# Altium project PLWD_Schematic.PrjPcb (part 2 of 2)

## Sheet PLWD_LTE_modem.SchDoc: UG96_Modem
size A3; Date: Not used; ApprovedBy: Not used; CheckedBy: Not used; Author: Not used; CompanyName: STMicroelectronics; DrawnBy: Not used; Engineer: Not used; Organization: Not used; Address1: Not used; Address2: Not used; Address3: Not used; Address4: Not used; DocumentNumber: 1; Revision: Not used; SheetNumber: 6; SheetTotal: 11; CurrentTime: Not used; CurrentDate: Not used; Time: Not used; DocumentFullPathAndName: Not used; DocumentName: Not used; ModifiedDate: Not used; ImagePath: Not used; ProjectName: Not used; Application_BuildNumber: Not used
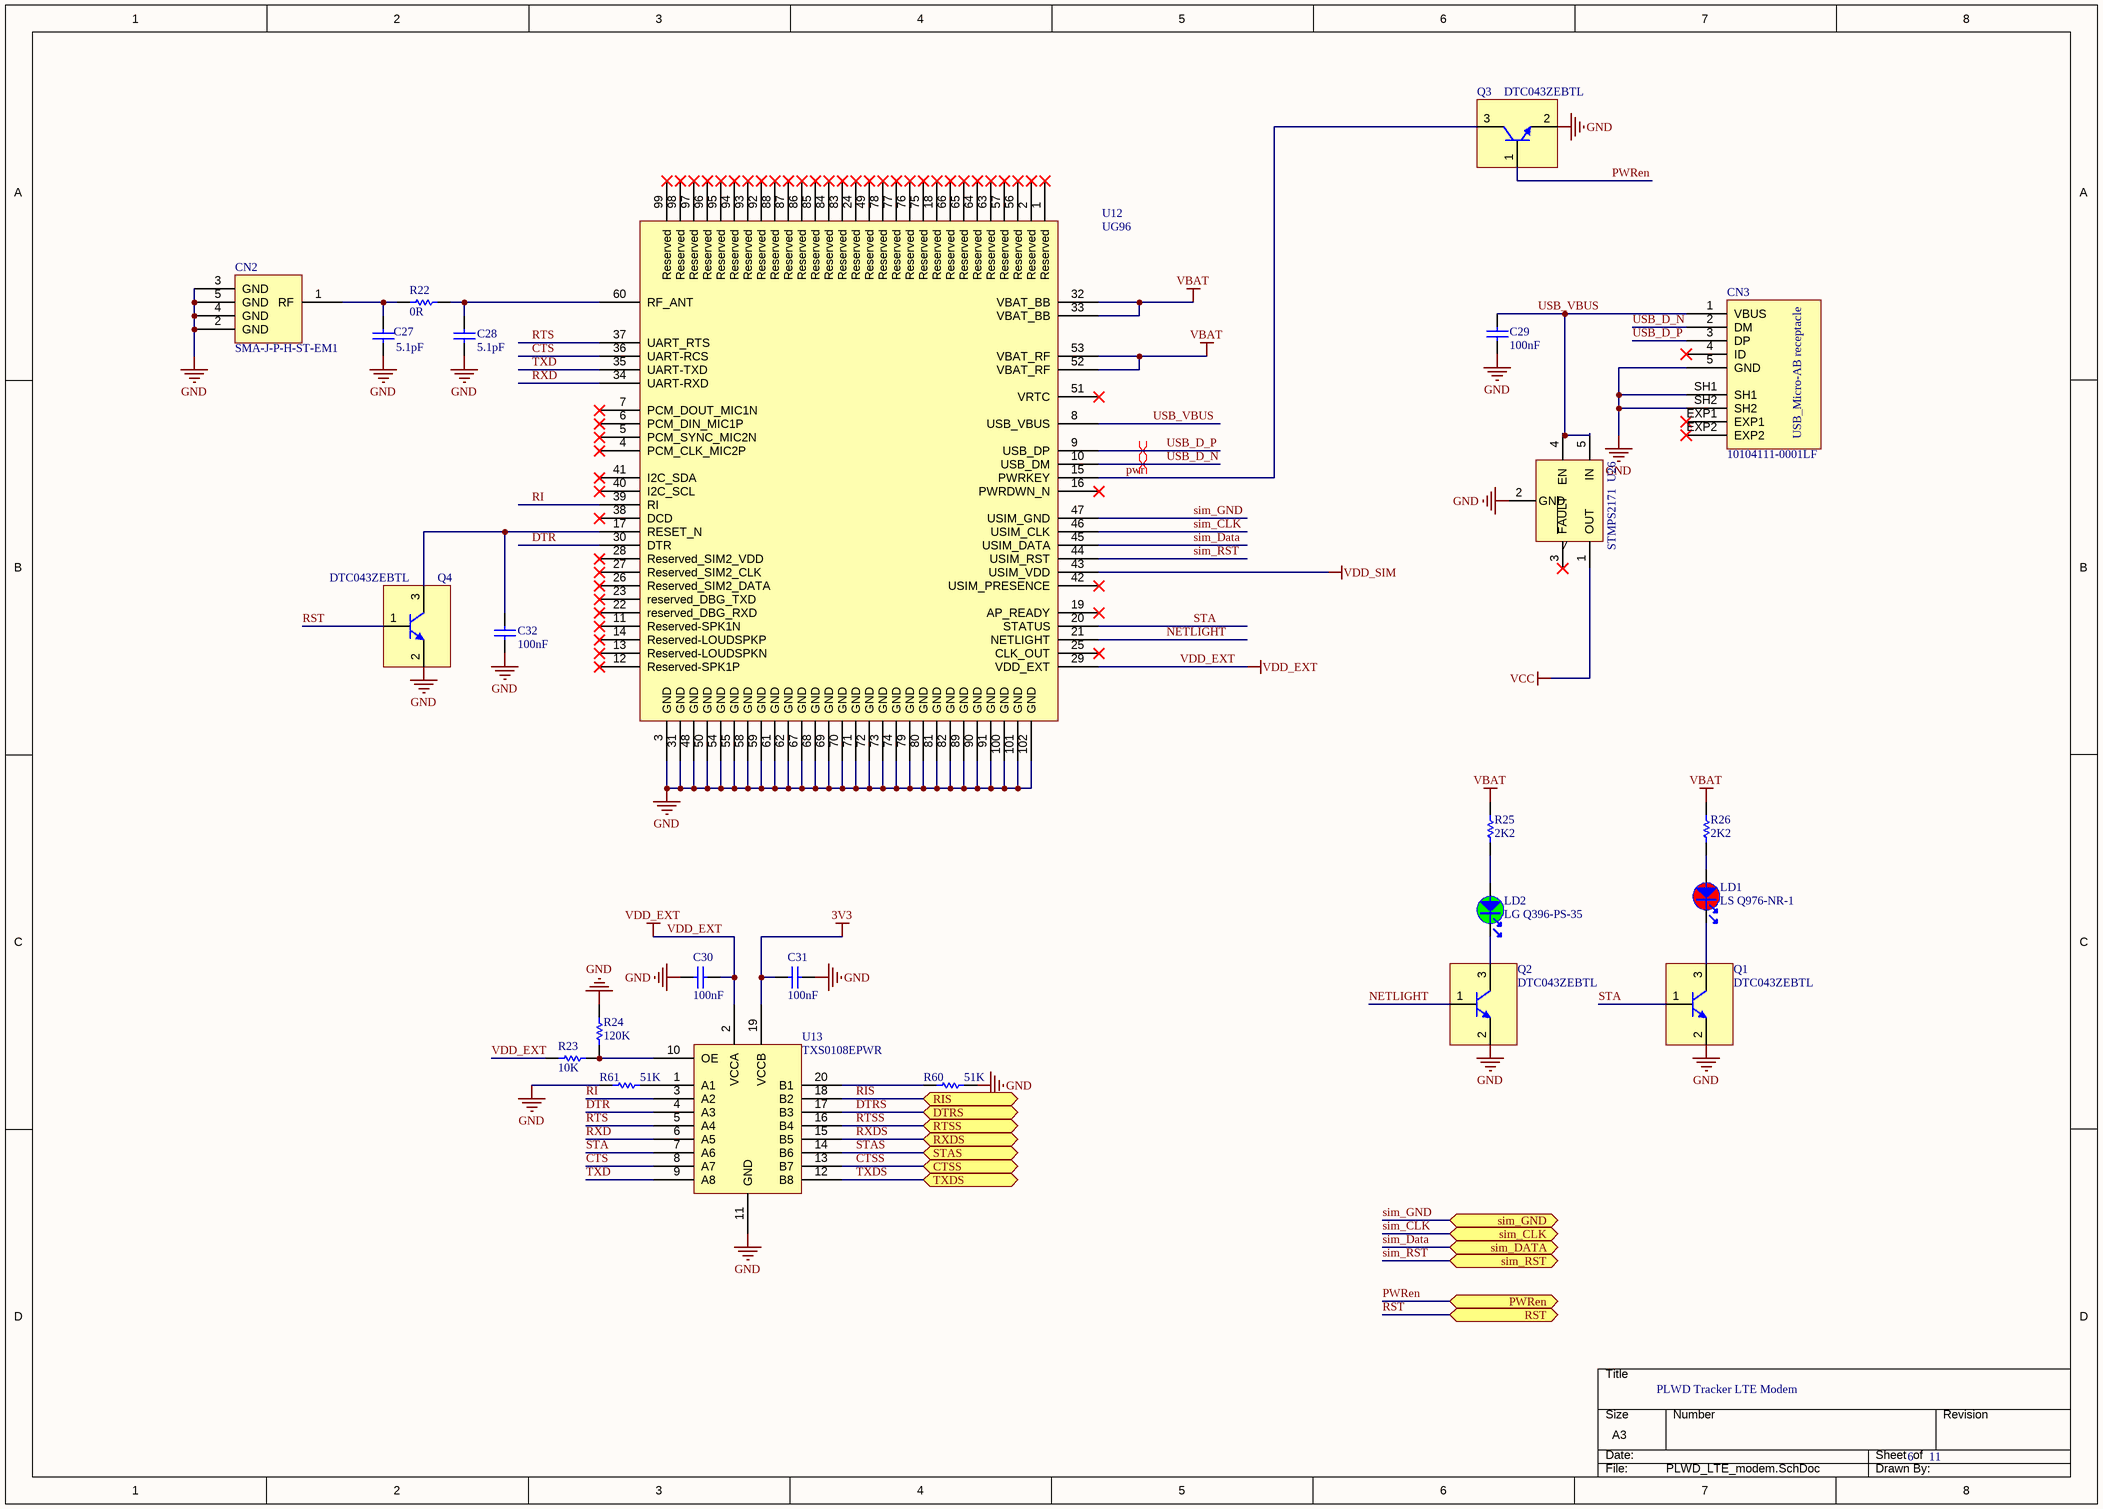
[diagram p8: PLWD_LTE_modem.SchDoc]

### Parts
C27  value 5.1pF  [C0402]  (hidden comment: Capacitor)
C28  value 5.1pF  [C0402]  (hidden comment: Capacitor)
C29  value 100nF  [C0402]  (hidden comment: Capacitor)
C30  value 100nF  [C0402]  (hidden comment: Capacitor)
C31  value 100nF  [C0402]  (hidden comment: Capacitor)
C32  value 100nF  [C0402]  (hidden comment: Capacitor)
CN2  SMA-J-P-H-ST-EM1  [CON_SAMTEC_SMA-J-P-X-ST-EM1]
CN3  value 10104111-0001LF  [CON_USBMICROAB_FCI_10104111-0001LF]  (hidden comment: USB_uAB_10104111-0001LF)
LD1  value LS Q976-NR-1  [LED_0603_RED]  (hidden comment: LED_red)
LD2  value LG Q396-PS-35  [LED_0603_GREEN]  (hidden comment: LED_green)
Q1  DTC043ZEBTL  [NPN_SOT416-FL_EMT3F_1616_SC89]
Q2  DTC043ZEBTL  [NPN_SOT416-FL_EMT3F_1616_SC89]
Q3  DTC043ZEBTL  [NPN_SOT416-FL_EMT3F_1616_SC89]
Q4  DTC043ZEBTL  [NPN_SOT416-FL_EMT3F_1616_SC89]
R22  value 0R  [R0402]  (hidden comment: Resistor)
R23  value 10K  [R0603]  (hidden comment: Resistor)
R24  value 120K  [R0402]  (hidden comment: Resistor)
R25  value 2K2  [R0402]  (hidden comment: Resistor)
R26  value 2K2  [R0402]  (hidden comment: Resistor)
R60  value 51K  [R0402]  (hidden comment: Resistor)
R61  value 51K  [R0402]  (hidden comment: Resistor)
U12  UG96  [MOD_2G-3G_QUECTEL_UG96-UG95-M95-R2-0_COMPATIBLE-DESIGN-V1-0]
U13  TXS0108EPWR  [ICC_TSSOP20_6P50X4P40_P065]
U26  value STMPS2171  [MOS_SOT23-5L]  (hidden comment: STMPS2171STR)

### Ports
CTSS (bidir), DTRS (bidir), PWRen (bidir), RIS (bidir), RST (bidir), RTSS (bidir), RXDS (bidir), sim_CLK (bidir), sim_DATA (bidir), sim_GND (bidir), sim_RST (bidir), STAS (bidir), TXDS (bidir)

### Nets
3V3: C31.1 U13.19(VCCB)
GND: C27.1 C28.1 C29.1 C30.1 C31.2 C32.1 CN2.2(GND) CN2.3(GND) CN2.4(GND) CN2.5(GND) CN3.5(GND) CN3.SH1 CN3.SH2 Q1.2(E) Q2.2(E) Q3.2(E) Q4.2(E) R24.2 R60.2 R61.1 U12.3(GND) U12.31(GND) U12.48(GND) U12.50(GND) U12.54(GND) U12.55(GND) U12.58(GND) U12.59(GND) U12.61(GND) U12.62(GND) U12.67(GND) U12.68(GND) U12.69(GND) U12.70(GND) U12.71(GND) U12.72(GND) U12.73(GND) U12.74(GND) U12.79(GND) U12.80(GND) U12.81(GND) U12.82(GND) U12.89(GND) U12.90(GND) U12.91(GND) U12.100(GND) U12.101(GND) U12.102(GND) U13.11(GND) U26.2(GND)
VBAT: R25.2 R26.2 U12.32(VBAT_BB) U12.33(VBAT_BB) U12.52(VBAT_RF) U12.53(VBAT_RF)
VCC: U26.1(OUT)
VDD_EXT: C30.2 R23.1 U12.29(VDD_EXT) U13.2(VCCA)
VDD_SIM: U12.43(USIM_VDD)
CTS: U12.36(UART-RCS) U13.8(A7)
CTSS: U13.13(B7) ; port CTSS
DTR: U12.30(DTR) U13.4(A3)
DTRS: U13.17(B3) ; port DTRS
NETLIGHT: Q2.1(B) U12.21(NETLIGHT)
pwr: Q3.3(C) U12.15(PWRKEY)
PWRen: Q3.1(B) ; port PWRen
RI: U12.39(RI) U13.3(A2)
RIS: U13.18(B2) ; port RIS
RST: Q4.1(B) U12.44(USIM_RST) ; port RST, port sim_RST  [also labelled sim_RST]
RTS: U12.37(UART_RTS) U13.5(A4)
RTSS: U13.16(B4) ; port RTSS
RXD: U12.34(UART-RXD) U13.6(A5)
RXDS: U13.15(B5) ; port RXDS
sim_CLK: U12.46(USIM_CLK) ; port sim_CLK
sim_Data: U12.45(USIM_DATA) ; port sim_DATA
sim_GND: U12.47(USIM_GND) ; port sim_GND
STA: Q1.1(B) U12.20(STATUS) U13.7(A6)
STAS: U13.14(B6) ; port STAS
TXD: U12.35(UART-TXD) U13.9(A8)
TXDS: U13.12(B8) ; port TXDS
USB_D_N: CN3.2(DM) U12.10(USB_DM)
USB_D_P: CN3.3(DP) U12.9(USB_DP)
USB_VBUS: C29.2 CN3.1(VBUS) U12.8(USB_VBUS) U26.4(EN) U26.5(IN)
NetC27_2: C27.2 CN2.1(RF) R22.1
NetC28_2: C28.2 R22.2 U12.60(RF_ANT)
NetC32_2: C32.2 Q4.3(C) U12.17(RESET_N)
NetLD1_1: LD1.1 R26.1
NetLD1_2: LD1.2 Q1.3(C)
NetLD2_1: LD2.1 R25.1
NetLD2_2: LD2.2 Q2.3(C)
NetR23_2: R23.2 R24.1 U13.10(OE)
NetR60_1: R60.1 U13.20(B1)
NetR61_2: R61.2 U13.1(A1)

Not connected (* = marked no-connect by the designer): CN3 4(ID)* EXP1* EXP2*; U12 1(Reserved)* 2(Reserved)* 4(PCM_CLK_MIC2P)* 5(PCM_SYNC_MIC2N)* 6(PCM_DIN_MIC1P)* 7(PCM_DOUT_MIC1N)* 11(Reserved-SPK1N)* 12(Reserved-SPK1P)* 13(Reserved-LOUDSPKN)* 14(Reserved-LOUDSPKP)* 16(PWRDWN_N)* 18(Reserved)* 19(AP_READY)* 22(reserved_DBG_RXD)* 23(reserved_DBG_TXD)* 24(Reserved)* 25(CLK_OUT)* 26(Reserved_SIM2_DATA)* 27(Reserved_SIM2_CLK)* 28(Reserved_SIM2_VDD)* 38(DCD)* 40(I2C_SCL)* 41(I2C_SDA)* 42(USIM_PRESENCE)* 49(Reserved)* 51(VRTC)* 56(Reserved)* 57(Reserved)* 63(Reserved)* 64(Reserved)* 65(Reserved)* 66(Reserved)* 75(Reserved)* 76(Reserved)* 77(Reserved)* 78(Reserved)* 83(Reserved)* 84(Reserved)* 85(Reserved)* 86(Reserved)* 87(Reserved)* 88(Reserved)* 92(Reserved)* 93(Reserved)* 94(Reserved)* 95(Reserved)* 96(Reserved)* 97(Reserved)* 98(Reserved)* 99(Reserved)*; U26 3(~{FAULT})*

### Layout directives
differential pair: USB_D_N, USB_D_P

### Notes on the sheet
- PLWD Tracker LTE Modem
- 6
- 11
- DWG NO:
- REV:
- THIS DOCUMENT AND THE DATA DISCLOSED HEREIN OR
- HEREWITH IS THE PROPERTY OF ALTIUM LIMITED AND MAY
- BE FREELY DISTRIBUTED IN WHOLE. NO RIGHTS ARE
- RESERVED OR EXPRESS OR IMPLIED WARANTEE GIVEN.
- REVISION
- DESCRIPTION
- DATE
- APPROVED
- ENG:
- APPROVALS
- PROJECT
- DSN:
- CHK:
- REFERENCE DOCUMENTS
- PROJECT REVISION:
- TITLE
- DOCUMENT REVISION:
- DESIGN ITEM:
- BOM:
- FAB DWG:
- PCB DWG:
- ASSY DWG:
- SCALE:
- A2
- SIZE
- CAGE CODE
- FILE NAME
- DWG NO.
- SHEET
- OF
- REV
- (in symbol MCD-01075) USB_Micro-AB receptacle

### Library data of the parts
C27 C28 = MCD-00003: Capacitor, 5.1pF, 50V, NPO, -+0.25pF, 0402, YAGEO; Manufacturer_Part_Number: CC0402CRNPO9BN5R1; Provided_By: Subcon; Internal_Part_Number: MCD-00003; PartType: Capacitors; ComponentLink1URL: Yageo_Capacitor_NP0_16V-to-50V.pdf; ECCN_US: n/a; ECCN_EU: n/a; Manufacturer: YAGEO; ComponentLink1Description: Yageo_Capacitor_NP0_16V-to-50V.pdf
C29-C32 = MCD-00006: Capacitor,100nF,16V,X7R,10%,0402,YAGEO; Manufacturer_Part_Number: CC0402KRX7R7BB104; Provided_By: Subcon; Internal_Part_Number: MCD-00006; PartType: Capacitors; ComponentLink1URL: Yageo_Capacitor_X7R-series.pdf; ECCN_US: n/a; ECCN_EU: n/a; Manufacturer: YAGEO; ComponentLink1Description: Yageo_Capacitor_X7R-series.pdf
CN2 = MCD-00279: RF SMA connector PCB edge; Manufacturer: SAMTEC; Provided_By: Subcon; Internal_Part_Number: MCD-00279; Value: SMA-J-P-H-ST-EM1; Status: check on going; PartType: Connectors; Manufacturer_Part_Number: SMA-J-P-H-ST-EM1; ComponentLink1Description: sma-j-p-x-st-em1-mkt.pdf
CN3 = MCD-01075: USB, micro AB receptacle,10104111-0001LF; Part_Type: Connector; Manufacturer: FCI; Provided_By: Subcon; Initial_Board_Reference: MB1329; Internal_Part_Number: MCD-01075; Status: Symbol available; Manufacturer_Part_Number: 10104111-0001LF; ComponentLink1Description: FCI_CONNECTOR_USB_uAB_10104111-0001LF; ComponentLink1URL: http://tunmcdsvn.tun.st.com/Component_Datasheet_Library/Trunk/Connectors/FCI_CONNECTOR_USB_uAB_10104111-0001LF; ECCN_US: n/a; ECCN_EU: n/a
LD1 = MCD-00332: red color LED; Manufacturer_Part_Number: Q65111A3964; Manufacturer: OSRAM; Provided_By: Subcon; Internal_Part_Number: MCD-00332; PartType: LED; ComponentLink1Description: LS Q976-NR-1.pdf
LD2 = MCD-00331: Green color LED; Manufacturer_Part_Number: Q65111A3964; Manufacturer: OSRAM; Provided_By: Subcon; Internal_Part_Number: MCD-00331; PartType: LED; ComponentLink1Description: LG Q396-PS-35.pdf
Q1-Q4 = MCD-00280: Buffer transistor; Manufacturer: Rohm; Provided_By: Subcon; Internal_Part_Number: MCD-00280; Value: DTC043ZEBTL; PartType: ICS; Manufacturer_Part_Number: DTC043ZEBTL; ComponentLink1Description: DTC043Z-series,pdf
R22 = MCD-00052: Resistor,0R,0402,5%,YAGEO; Manufacturer_Part_Number: RC0402JR-070RL; Provided_By: Subcon; Internal_Part_Number: MCD-00052; PartType: Resistors; ComponentLink1URL: Yageo_Resistor_RC0402-series.pdf; ECCN_US: n/a; ECCN_EU: n/a; Manufacturer: YAGEO; ComponentLink1Description: Yageo_Resistor_RC0402-series.pdf
R23 = MCD-00220: Resistor,10K,0603,1%,YAGEO; Manufacturer_Part_Number: RC0603FR-0710KL; Provided_By: Subcon; Internal_Part_Number: MCD-00220; PartType: Resistors; ComponentLink1URL: Yageo_Resistor_RC0603-series.pdf; ECCN_US: n/a; ECCN_EU: n/a; Manufacturer: YAGEO; ComponentLink1Description: Yageo_Resistor_RC0603-series.pdf
R24 = MCD-00166: Resistor,120K,0402,1%,YAGEO; Manufacturer_Part_Number: RC0402FR-07120KL; Provided_By: Subcon; Internal_Part_Number: MCD-00166; PartType: Resistors; ComponentLink1URL: Yageo_Resistor_RC0402-series.pdf; ECCN_US: n/a; ECCN_EU: n/a; Manufacturer: YAGEO; ComponentLink1Description: Yageo_Resistor_RC0402-series.pdf
R25 R26 = MCD-00057: Resistor,2K2,0402,1%,YAGEO; Manufacturer_Part_Number: RC0402FR-072K2L; Provided_By: Subcon; Internal_Part_Number: MCD-00057; PartType: Resistors; ComponentLink1URL: Yageo_Resistor_RC0402-series.pdf; ECCN_US: n/a; ECCN_EU: n/a; Manufacturer: YAGEO; ComponentLink1Description: Yageo_Resistor_RC0402-series.pdf
R60 R61 = MCD-00294: Resistor,51K,0402,1%,YAGEO; Manufacturer_Part_Number: RC0402FR-0751KL; Provided_By: Subcon; Internal_Part_Number: MCD-00294; PartType: Resistors; Manufacturer: YAGEO; ComponentLink1Description: Yageo_Resistor_RC0402-series.pdf; ComponentLink1URL: Yageo_Resistor_RC0402-series.pdf; ECCN_US: n/a; ECCN_EU: n/a
U12 = MCD-00290: cellular modem; Manufacturer: QUECTEL; Provided_By: Subcon; Internal_Part_Number: MCD-00290; Value: UG96; PartType: ICS; Manufacturer_Part_Number: UG96; ComponentLink1Description: UG96_95.pdf
U13 = MCD-00289: bidirectionnal level shifter; Manufacturer: TEXAS INSTRUMENTS; Provided_By: Subcon; Internal_Part_Number: MCD-00289; Value: TXS0108EPWR; PartType: ICS; Manufacturer_Part_Number: TXS0108EPWR; ComponentLink1Description: TXS0108EPWR.pdf
U26 = MCD-00622: IC, 1000mA Enhanced single channel power switches with active high enable pin, 90mR, SOT23-5L; Manufacturer: STMICROELECTRONICS; Provided_By: Subcon; Initial_Board_Reference: MB1264; Internal_Part_Number: MCD-00622; Status: Footprint available; Part_Type: IC; Manufacturer_Part_Number: STMPS2171STR; ComponentLink1Description: STM_PWR-Switch_STMPS2171STR.pdf; ComponentLink1URL: http://tunmcdsvn.tun.st.com/Component_Datasheet_Library/Trunk/IC/STM_PWR-Switch_STMPS2171STR

## Sheet PLWD_LTE_Power.SchDoc: Power
size A3; Date: Not used; ApprovedBy: Not used; CheckedBy: Not used; Author: Not used; CompanyName: STMicroelectronics; DrawnBy: Not used; Engineer: Not used; Organization: Not used; Address1: Not used; Address2: Not used; Address3: Not used; Address4: Not used; DocumentNumber: 3; Revision: Not used; SheetNumber: 7; SheetTotal: 11; CurrentTime: Not used; CurrentDate: Not used; Time: Not used; DocumentFullPathAndName: Not used; DocumentName: Not used; ModifiedDate: Not used; ImagePath: Not used; ProjectName: Not used; Application_BuildNumber: Not used
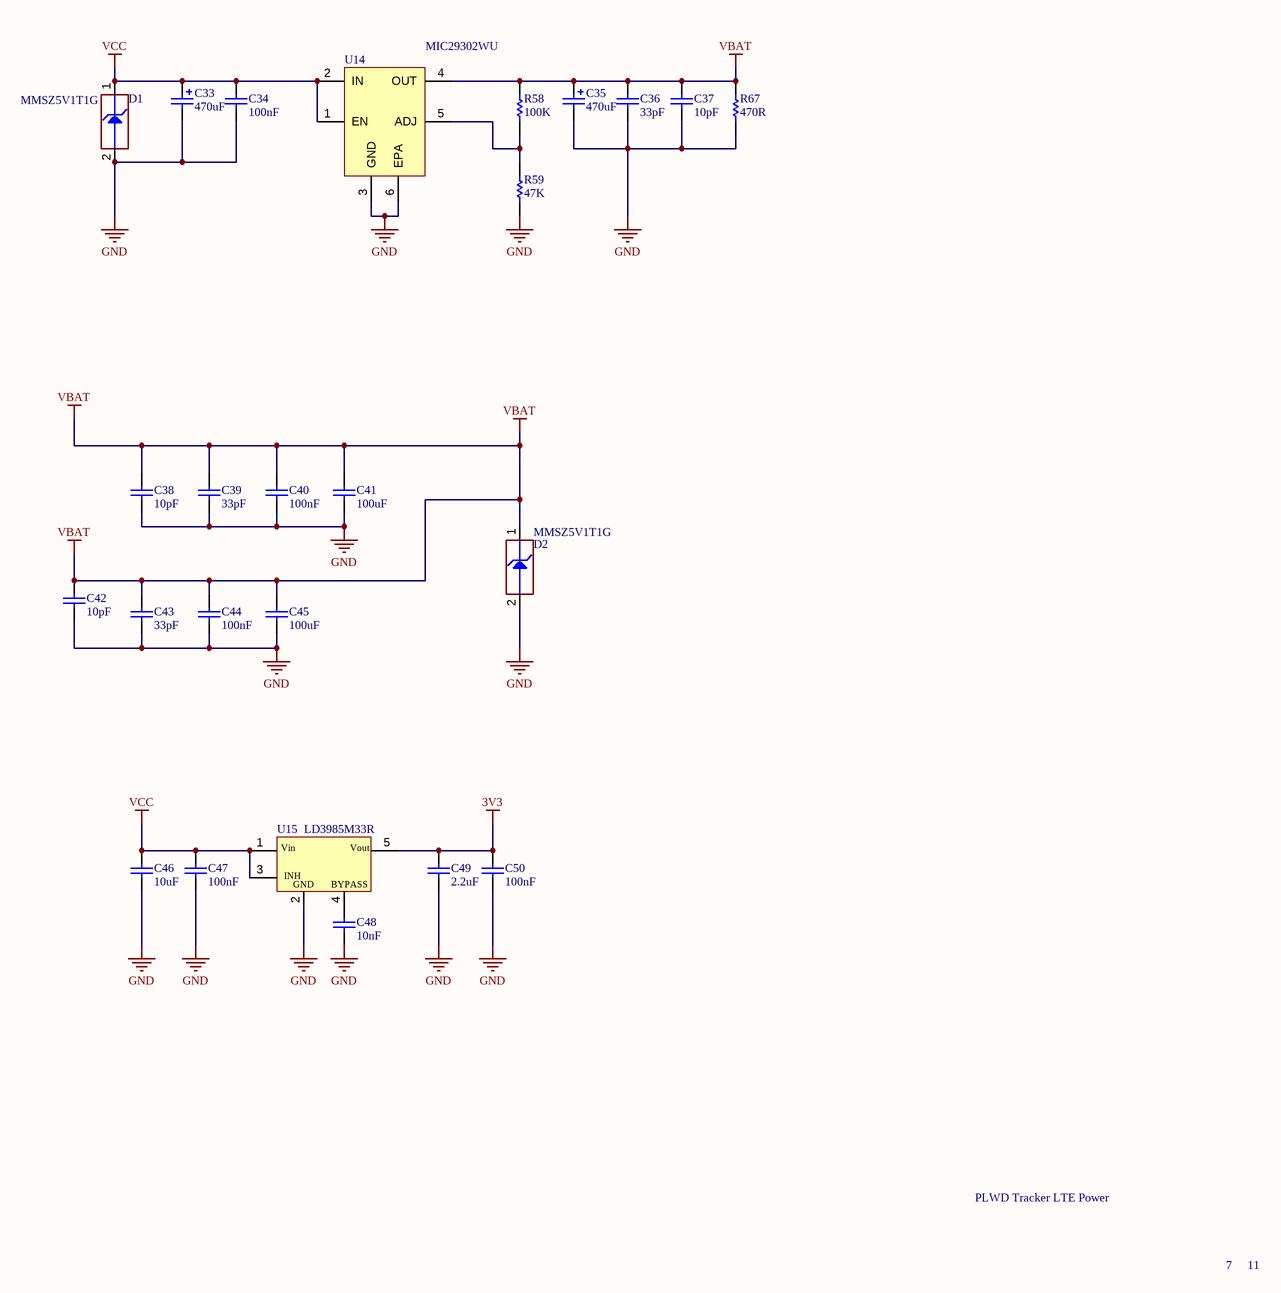
[diagram p9: PLWD_LTE_Power.SchDoc]

### Parts
C33  value 470uF  [CPOL_SANIO_TPB-D4_H380]  (hidden comment: Cap_POL_TANA)
C34  value 100nF  [C0402]  (hidden comment: Capacitor)
C35  value 470uF  [CPOL_SANIO_TPB-D4_H380]  (hidden comment: Cap_POL_TANA)
C36  value 33pF  [C0402]  (hidden comment: Capacitor)
C37  value 10pF  [C0402]  (hidden comment: Capacitor)
C38  value 10pF  [C0402]  (hidden comment: Capacitor)
C39  value 33pF  [C0402]  (hidden comment: Capacitor)
C40  value 100nF  [C0402]  (hidden comment: Capacitor)
C41  value 100uF  [C1210]  (hidden comment: Capacitor)
C42  value 10pF  [C0402]  (hidden comment: Capacitor)
C43  value 33pF  [C0402]  (hidden comment: Capacitor)
C44  value 100nF  [C0402]  (hidden comment: Capacitor)
C45  value 100uF  [C1210]  (hidden comment: Capacitor)
C46  value 10uF  [C0603]  (hidden comment: Capacitor)
C47  value 100nF  [C0402]  (hidden comment: Capacitor)
C48  value 10nF  [C0402]  (hidden comment: Capacitor)
C49  value 2.2uF  [C0603]  (hidden comment: Capacitor)
C50  value 100nF  [C0402]  (hidden comment: Capacitor)
D1  MMSZ5V1T1G  [DIOZ_SOD123_1K_2A]
D2  MMSZ5V1T1G  [DIOZ_SOD123_1K_2A]
R58  value 100K  [R0402]  (hidden comment: Resistor)
R59  value 47K  [R0402]  (hidden comment: Resistor)
R67  value 470R  [R0402]  (hidden comment: Resistor)
U14  MIC29302WU  [LDO_TO263-5L-EPAD_D2PAK_P170]
U15  LD3985M33R  [REG_SOT23-5L]

### Nets
3V3: C49.2 C50.2 U15.5(Vout)
GND: C33.2 C34.2 C35.2 C36.1 C37.1 C38.1 C39.1 C40.2 C41.1 C42.1 C43.1 C44.2 C45.1 C46.1 C47.1 C48.2 C49.1 C50.1 D1.2(A) D2.2(A) R59.1 R67.1 U14.3(GND) U14.6(EPA) U15.2(GND)
VBAT: C35.1 C36.2 C37.2 C38.2 C39.2 C40.1 C41.2 C42.2 C43.2 C44.1 C45.2 D2.1(K) R58.2 R67.2 U14.4(OUT)
VCC: C33.1 C34.1 C46.2 C47.2 D1.1(K) U14.1(EN) U14.2(IN) U15.1(Vin) U15.3(CE)
NetC48_1: C48.1 U15.4(BYPASS)
NetR58_1: R58.1 R59.2 U14.5(ADJ)

### Notes on the sheet
- PLWD Tracker LTE Power
- 7
- 11
- DWG NO:
- REV:
- THIS DOCUMENT AND THE DATA DISCLOSED HEREIN OR
- HEREWITH IS THE PROPERTY OF ALTIUM LIMITED AND MAY
- BE FREELY DISTRIBUTED IN WHOLE. NO RIGHTS ARE
- RESERVED OR EXPRESS OR IMPLIED WARANTEE GIVEN.
- REVISION
- DESCRIPTION
- DATE
- APPROVED
- ENG:
- APPROVALS
- PROJECT
- DSN:
- CHK:
- REFERENCE DOCUMENTS
- PROJECT REVISION:
- TITLE
- DOCUMENT REVISION:
- DESIGN ITEM:
- BOM:
- FAB DWG:
- PCB DWG:
- ASSY DWG:
- SCALE:
- A2
- SIZE
- CAGE CODE
- FILE NAME
- DWG NO.
- SHEET
- OF
- REV
- (in symbol MCD-00086) INH

### Library data of the parts
C33 C35 = MCD-00278: capacitor 470uF 6,3V 20% SANYO; Manufacturer_Part_Number: 6TPB470M; Provided_By: Subcon; Revision: July-2002: Re-released for DXP Platform.; Internal_Part_Number: MCD-00278; PartType: CAP; Manufacturer: SANYO; ComponentLink1Description: TPB_Series.pdf
C34 C40 C44 C47 C50 = MCD-00006: as C29 on sheet PLWD_LTE_modem; Internal_Part_Number: MCD-00006; PartType: Capacitors; Manufacturer: YAGEO; ComponentLink1Description: Yageo_Capacitor_X7R-series.pdf; ComponentLink1URL: Yageo_Capacitor_X7R-series.pdf; ECCN_US: n/a; ECCN_EU: n/a
C36 C39 C43 = MCD-00277: capacitor 33pF 50V 5% 0402 COG YAGEO; Manufacturer_Part_Number: CC0402JRNPO9BN330; Provided_By: Subcon; Internal_Part_Number: MCD-00277; PartType: CAP; Manufacturer: YAGEO; ComponentLink1Description: Yageo_COG_series.pdf
C37 C38 C42 = MCD-00015: Capacitor,10pF,50V,NPO,5%,0402,YAGEO; Manufacturer_Part_Number: CC0402JRNPO9BN100; Provided_By: subcon; Internal_Part_Number: MCD-00015; PartType: Capacitors; ComponentLink1URL: Yageo_Capacitor_NP0_16V-to-50V.pdf; ECCN_US: n/a; ECCN_EU: n/a; Manufacturer: YAGEO; ComponentLink1Description: Yageo_Capacitor_NP0_16V-to-50V.pdf
C41 C45 = MCD-00103: Capacitor,100uF,6V3,X5R,10%,1210; Manufacturer_Part_Number: 12106D107KAT2A; Manufacturer: AVX; Internal_Part_Number: MCD-00103; PartType: Capacitors; ComponentLink1Description: 12106D107KAT2A
C46 = MCD-00243: Capacitor,10uF,6V3,X5R,10%,0603,YAGEO; Manufacturer_Part_Number: CC0603KRX5R5BB106; Provided_By: Subcon; Internal_Part_Number: MCD-00243; PartType: Capacitors; Manufacturer: YAGEO; ComponentLink1Description: Yageo_Capacitor_X5R-series.pdf; ComponentLink1URL: Yageo_Capacitor_X5R-series.pdf; ECCN_US: n/a; ECCN_EU: n/a
C48 = MCD-00011: Capacitor,10nF,16V,X7R,10%,0402,YAGEO; Manufacturer_Part_Number: CC0402KRX7R7BB103; Provided_By: Subcon; Internal_Part_Number: MCD-00011; PartType: Capacitors; Manufacturer: YAGEO; ComponentLink1Description: Yageo_Capacitor_X7R-series.pdf; ComponentLink1URL: Yageo_Capacitor_X7R-series.pdf; ECCN_US: n/a; ECCN_EU: n/a
C49 = MCD-00012: Capacitor,2.2uF,10V, X5R,10%,0603,YAGEO; Manufacturer_Part_Number: CC0603KRX5R6BB225; Alternate_Manufacturer_Part_Number: C0603C225K8PACTU; Alternate_Manufacturer: KEMET; Provided_By: Subcon; Internal_Part_Number: MCD-00012; PartType: Capacitors; Manufacturer: YAGEO; ComponentLink1Description: Yageo_Capacitor_X5R-series.pdf; ComponentLink1URL: Yageo_Capacitor_X5R-series.pdf; ComponentLink2Description: KEMET_Capacitor_X7R-series.pdf; ComponentLink2URL: KEMET_Capacitor_X7R-series.pdf; ECCN_US: n/a; ECCN_EU: n/a
D1 D2 = MCD-00330: Diode zener; Manufacturer: Onsemi; Provided_By: Subcon; Internal_Part_Number: MCD-00330; Value: MMSZ5V1T1G; PartType: ICS; Manufacturer_Part_Number: MMSZ5V1T1G; ComponentLink1Description: MMSZ5V1T1G.pdf
R58 = MCD-00059: Resistor,100K,0402,1%,YAGEO; Manufacturer_Part_Number: RC0402FR-07100KL; Alternate_Manufacturer_Part_Number: RT0402FRE07100KL; Provided_By: Subcon; Internal_Part_Number: MCD-00059; PartType: Resistors; ComponentLink1URL: Yageo_Resistor_RC0402-series.pdf; ECCN_US: n/a; ECCN_EU: n/a; Manufacturer: YAGEO; Alternate_Manufacturer: YAGEO; ComponentLink1Description: Yageo_Resistor_RC0402-series.pdf
R59 = MCD-00063: Resistor,47K,0402,1%,YAGEO; Manufacturer_Part_Number: RC0402FR-0747KL; Provided_By: Subcon; Internal_Part_Number: MCD-00063; PartType: Resistors; ComponentLink1URL: Yageo_Resistor_RC0402-series.pdf; ECCN_US: n/a; ECCN_EU: n/a; Manufacturer: YAGEO; ComponentLink1Description: Yageo_Resistor_RC0402-series.pdf
R67 = MCD-00178: Resistor,470R,0402,1%,YAGEO; Manufacturer_Part_Number: RC0402FR-07470RL; Provided_By: Subcon; Internal_Part_Number: MCD-00178; PartType: Resistors; ComponentLink1URL: Yageo_Resistors_RC0402; Manufacturer: YAGEO; ComponentLink1Description: Yageo_Resistors_RC0402
U14 = MCD-00283: LDO Ajustable, VOUT=1V25-to-25V,3A,VINmax=26V; Manufacturer: MICREL; Provided_By: Subcon; Internal_Part_Number: MCD-00283; Value: MIC29302WU; PartType: ICS; Manufacturer_Part_Number: MIC29302WU; ComponentLink1Description: MIC29302WU,pdf
U15 = MCD-00086: Ultra low drop-low noise BiCMOS voltage, regulators low ESR capacitors compatible; Manufacturer: STM; ECCN_US: EAR99; ECCN_EU: NEC; Internal_Part_Number: MCD-00086; Value: LD3985M33R; PartType: IC; Manufacturer_Part_Number: LD3985M33R; ComponentLink1Description: STM_LDO_LD3985.pdf; ComponentLink1URL: STM_LDO_LD3985.pdf; Provided_By: STM

## Sheet PLWD_LTE_SIM.SchDoc: SIM
size A3; Date: Not used; ApprovedBy: Not used; CheckedBy: Not used; Author: Not used; CompanyName: STMicroelectronics; DrawnBy: Not used; Engineer: Not used; Organization: Not used; Address1: Not used; Address2: Not used; Address3: Not used; Address4: Not used; DocumentNumber: 4; Revision: Not used; SheetNumber: 8; SheetTotal: 11; CurrentTime: Not used; CurrentDate: Not used; Time: Not used; DocumentFullPathAndName: Not used; DocumentName: Not used; ModifiedDate: Not used; ImagePath: Not used; ProjectName: Not used; Application_BuildNumber: Not used
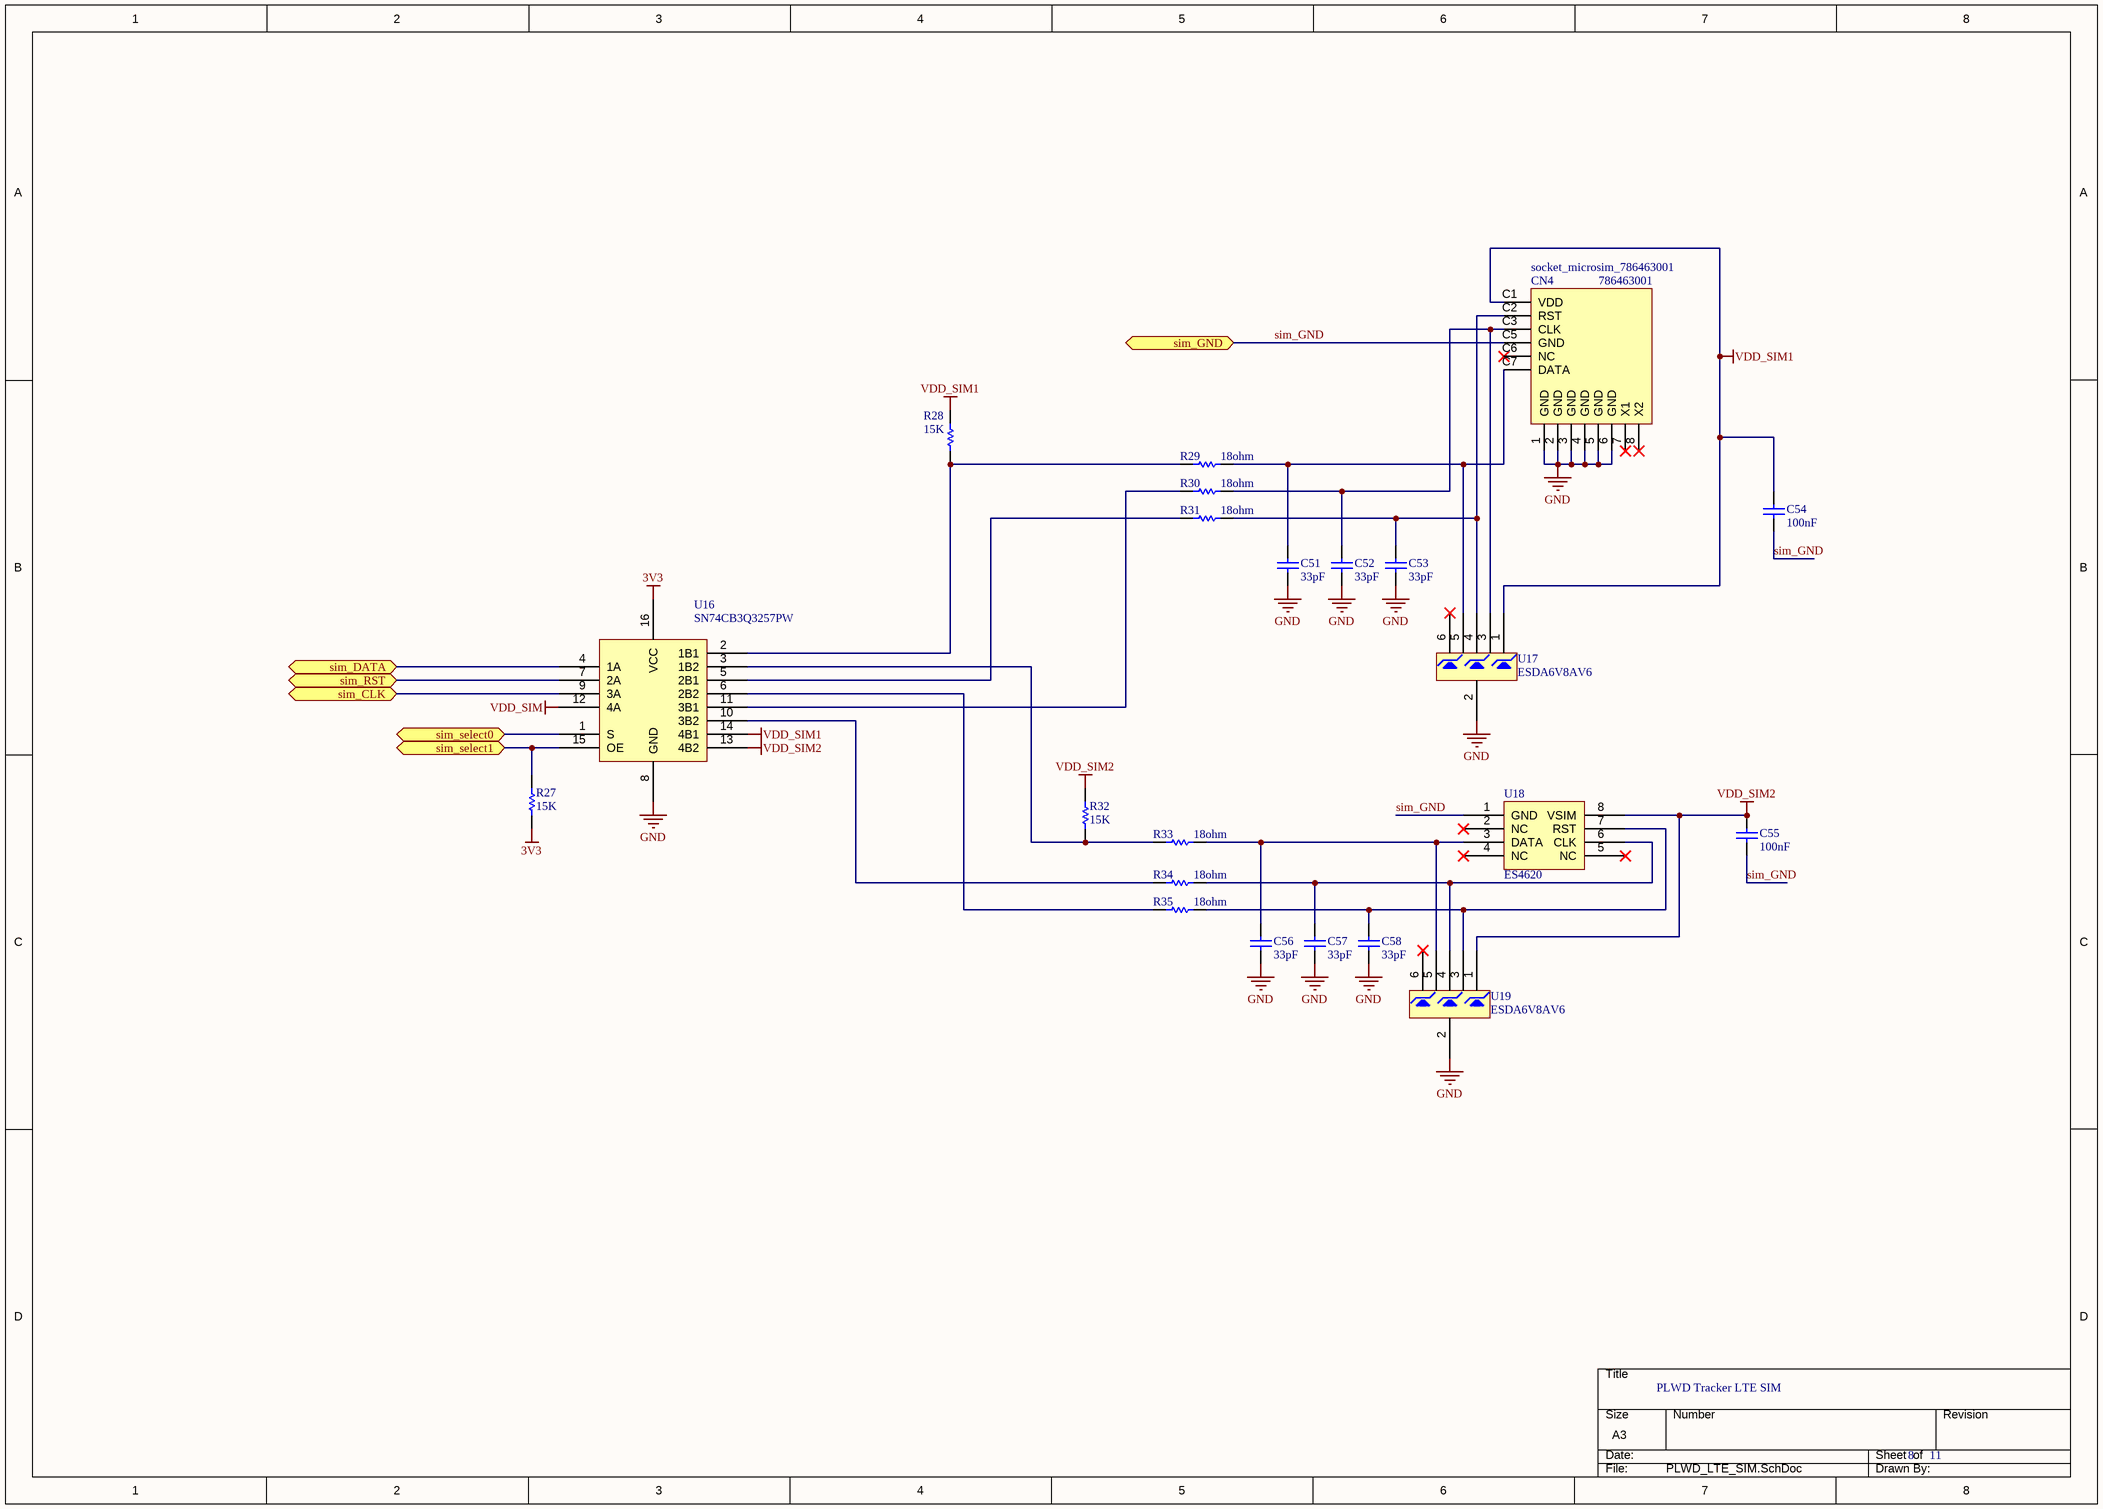
[diagram p10: PLWD_LTE_SIM.SchDoc]

### Parts
C51  value 33pF  [C0402]  (hidden comment: Capacitor)
C52  value 33pF  [C0402]  (hidden comment: Capacitor)
C53  value 33pF  [C0402]  (hidden comment: Capacitor)
C54  value 100nF  [C0402]  (hidden comment: Capacitor)
C55  value 100nF  [C0402]  (hidden comment: Capacitor)
C56  value 33pF  [C0402]  (hidden comment: Capacitor)
C57  value 33pF  [C0402]  (hidden comment: Capacitor)
C58  value 33pF  [C0402]  (hidden comment: Capacitor)
CN4  socket_microsim_786463001  value 786463001  [CON_MICRO-SIMCARD_MOLEX_SD-78646-3001]
R27  value 15K  [R0402]  (hidden comment: Resistor)
R28  value 15K  [R0402]  (hidden comment: Resistor)
R29  value 18ohm  [R0402]  (hidden comment: Resistor)
R30  value 18ohm  [R0402]  (hidden comment: Resistor)
R31  value 18ohm  [R0402]  (hidden comment: Resistor)
R32  value 15K  [R0402]  (hidden comment: Resistor)
R33  value 18ohm  [R0402]  (hidden comment: Resistor)
R34  value 18ohm  [R0402]  (hidden comment: Resistor)
R35  value 18ohm  [R0402]  (hidden comment: Resistor)
U16  SN74CB3Q3257PW  [ICC_TSSOP16_5P1X4P5_P065]
U17  ESDA6V8AV6  [ESD_SOT563-6L_P050]
U18  ES4620  [CON_SIMCARD_ESEYE_ES4620]
U19  ESDA6V8AV6  [ESD_SOT563-6L_P050]

### Ports
sim_CLK (bidir), sim_DATA (bidir), sim_GND (bidir), sim_RST (bidir), sim_select0 (bidir), sim_select1 (bidir)

### Nets
3V3: R27.1 U16.16(VCC)
GND: C51.1 C52.1 C53.1 C56.1 C57.1 C58.1 CN4.1(GND) CN4.2(GND) CN4.3(GND) CN4.4(GND) CN4.5(GND) CN4.6(GND) U16.8(GND) U17.2 U19.2
VDD_SIM: U16.12(4A)
VDD_SIM1: C54.2 CN4.C1(VDD) R28.2 U16.14(4B1) U17.1
VDD_SIM2: C55.2 R32.2 U16.13(4B2) U18.8(VSIM) U19.1
RST: U16.7(2A) ; port sim_RST
sim_CLK: U16.9(3A) ; port sim_CLK
sim_Data: U16.4(1A) ; port sim_DATA
sim_GND: C54.1 C55.1 CN4.C5(GND) U18.1(GND) ; port sim_GND
NetC51_2: C51.2 CN4.C7(DATA) R29.2 U17.5
NetC52_2: C52.2 CN4.C3(CLK) R30.2 U17.3
NetC53_2: C53.2 CN4.C2(RST) R31.2 U17.4
NetC56_2: C56.2 R33.2 U18.3(DATA) U19.5
NetC57_2: C57.2 R34.2 U18.6(CLK) U19.4
NetC58_2: C58.2 R35.2 U18.7(RST) U19.3
NetR27_2: R27.2 U16.15(OE) ; port sim_select1
NetR28_1: R28.1 R29.1 U16.2(1B1)
NetR30_1: R30.1 U16.11(3B1)
NetR31_1: R31.1 U16.5(2B1)
NetR32_1: R32.1 R33.1 U16.3(1B2)
NetR34_1: R34.1 U16.10(3B2)
NetR35_1: R35.1 U16.6(2B2)
NetU1_74: U16.1(S) ; port sim_select0

Not connected (* = marked no-connect by the designer): CN4 7(X1)* 8(X2)* C6(NC)*; U17 6*; U18 2(NC)* 4(NC)* 5(NC)*; U19 6*

### Notes on the sheet
- PLWD Tracker LTE SIM
- 8
- 11
- DWG NO:
- REV:
- THIS DOCUMENT AND THE DATA DISCLOSED HEREIN OR
- HEREWITH IS THE PROPERTY OF ALTIUM LIMITED AND MAY
- BE FREELY DISTRIBUTED IN WHOLE. NO RIGHTS ARE
- RESERVED OR EXPRESS OR IMPLIED WARANTEE GIVEN.
- REVISION
- DESCRIPTION
- DATE
- APPROVED
- ENG:
- APPROVALS
- PROJECT
- DSN:
- CHK:
- REFERENCE DOCUMENTS
- PROJECT REVISION:
- TITLE
- DOCUMENT REVISION:
- DESIGN ITEM:
- BOM:
- FAB DWG:
- PCB DWG:
- ASSY DWG:
- SCALE:
- A2
- SIZE
- CAGE CODE
- FILE NAME
- DWG NO.
- SHEET
- OF
- REV

### Library data of the parts
C51-C53 C56-C58 = MCD-00277: as C36 on sheet PLWD_LTE_Power; Internal_Part_Number: MCD-00277; PartType: CAP; Manufacturer: YAGEO; ComponentLink1Description: Yageo_COG_series.pdf
C54 C55 = MCD-00006: as C29 on sheet PLWD_LTE_modem; Internal_Part_Number: MCD-00006; PartType: Capacitors; Manufacturer: YAGEO; ComponentLink1Description: Yageo_Capacitor_X7R-series.pdf; ComponentLink1URL: Yageo_Capacitor_X7R-series.pdf; ECCN_US: n/a; ECCN_EU: n/a
CN4 = MCD-01019: Socket_microsim 16*13, height 1.45mm; Part_Type: Connector; Manufacturer: MOLEX; Provided_By: Subcon; Initial_Board_Reference: MB1329; Internal_Part_Number: MCD-01019; Status: New; Manufacturer_Part_Number: 786463001; ComponentLink1Description: Micro_Sim_Card_socket_786463001; ComponentLink1URL: http://tunmcdsvn.tun.st.com/Component_Datasheet_Library/Trunk/Connectors/Molex_Connector_Micro_Sim_Card_socket_786463001/Molex_Connector_Micro_Sim_Card_socket_786463001.pdf; ECCN_US: N/A; ECCN_EU: N/A
R27 = MCD-00285: Resistor,15K,0402,5%; Manufacturer_Part_Number: RC0402JR-0715KL; Manufacturer: YAGEO; Provided_By: Subcon; Internal_Part_Number: MCD-00285; PartType: RES; ComponentLink1Description: Yageo_Resistor_RC0402-series.pdf; ECCN_US: n/a; ECCN_EU: n/a
R28 R32 = MCD-00285: resistor, 15K 0402 5%; Manufacturer_Part_Number: RC0402JR-0715KL; Manufacturer: YAGEO; Provided_By: Subcon; Internal_Part_Number: MCD-00285; PartType: RES; ComponentLink1Description: RC_Lseries,pdf
R29-R31 R33-R35 = MCD-00286: resistor, 18 0402 5%; Manufacturer_Part_Number: RC0402jR-0718RL; Manufacturer: YAGEO; Provided_By: Subcon; Internal_Part_Number: MCD-00286; PartType: RES; ComponentLink1Description: RC_Lseries,pdf
U16 = MCD-00287: switch multiplexer; Manufacturer: TEXAS INSTRUMENTS; Provided_By: Subcon; Internal_Part_Number: MCD-00287; Value: SN74CB3Q3257PW; PartType: ICS; Manufacturer_Part_Number: SN74CB3Q3257PW; ComponentLink1Description: SN74CB3Q3257PW.pdf
U17 U19 = MCD-00282: ESD protection; Manufacturer: WILLSEMI; Provided_By: Subcon; Internal_Part_Number: MCD-00282; Value: ESDA6V8AV6; PartType: ICS; Manufacturer_Part_Number: ESDA6V8AV6; ComponentLink1Description: ESDA6V8AV6,pdf
U18 = MCD-00281: embedded SIM; Manufacturer: ESEYE; Provided_By: Subcon; Internal_Part_Number: MCD-00281; Value: ES4620; PartType: ICS; Manufacturer_Part_Number: ES4620; ComponentLink1Description: 8337-AnyNet-Multi-IMSI-SIM-Specification-Sheet.pdf

## Nets that join several sheets
3V3: PLWD_MCU_IO (5 pins), PLWD_USB (R37.2), PLWD_LTE_modem (C31.1 U13.19), PLWD_LTE_Power (C49.2 C50.2 U15.5), PLWD_LTE_SIM (R27.1 U16.16)
GND: PLWD_MCU_IO (22 pins), PLWD_Bluetooth (C6.1 R9.1 U3.11), PLWD_GNSS_RF (17 pins), PLWD_USB (6 pins), PLWD_harvesting (17 pins), PLWD_GNSS_1 (24 pins), PLWD_Battery_Charger (5 pins), PLWD_LTE_modem (50 pins), PLWD_LTE_Power (25 pins), PLWD_LTE_SIM (15 pins)
VBAT: PLWD_MCU_IO (13 pins), PLWD_LTE_modem (6 pins), PLWD_LTE_Power (15 pins)
VCC: PLWD_LTE_modem (U26.1), PLWD_LTE_Power (9 pins)
VDD_SIM: PLWD_LTE_modem (U12.43), PLWD_LTE_SIM (U16.12)
Ant_In: PLWD_GNSS_RF (5 pins), PLWD_GNSS_1 (U11.11)
AntOFF: PLWD_GNSS_RF (R10.2 R14.2 R15.1 U5.4), PLWD_GNSS_1 (U11.13)
CTSS: PLWD_MCU_IO (U1.80), PLWD_LTE_modem (U13.13)
DTRS: PLWD_MCU_IO (U1.18), PLWD_LTE_modem (U13.17)
NetR8_2: PLWD_MCU_IO (R8.2 U1.35 U2.6), PLWD_Bluetooth (U3.10), PLWD_harvesting (R52.1 U24.4)
NetR27_2: PLWD_MCU_IO (U1.13), PLWD_LTE_SIM (R27.2 U16.15)
NetR42_1: PLWD_harvesting (7 pins), PLWD_Battery_Charger (R42.1)
NetU1_36: PLWD_MCU_IO (U1.36), PLWD_GNSS_1 (U10.4)
NetU1_74: PLWD_MCU_IO (U1.74), PLWD_LTE_SIM (U16.1)
NetU1_139: PLWD_MCU_IO (U1.139), PLWD_GNSS_1 (U7.1)
NetU1_140: PLWD_MCU_IO (U1.140), PLWD_GNSS_1 (U7.8)
PA6: PLWD_MCU_IO (U1.42 U2.2), PLWD_Bluetooth (U3.9), PLWD_harvesting (S1.1)
PA7: PLWD_MCU_IO (U1.43 U2.5), PLWD_Bluetooth (U3.8), PLWD_harvesting (S1.3)
PA9: PLWD_MCU_IO (U1.101), PLWD_USB (CN5.1 R36.1 U25.5), PLWD_Battery_Charger (C59.2 U20.6)
PA10: PLWD_MCU_IO (U1.102), PLWD_USB (CN5.2 U25.1)
PA11: PLWD_MCU_IO (U1.103), PLWD_USB (CN5.3 U25.3 U25.4 U25.6)
PA12: PLWD_MCU_IO (U1.104), PLWD_USB (CN5.4 D3.2)
PPS: PLWD_MCU_IO (U1.69), PLWD_GNSS_1 (U11.4)
PWRen: PLWD_MCU_IO (U1.14), PLWD_LTE_modem (Q3.1)
RIS: PLWD_MCU_IO (U1.19), PLWD_LTE_modem (U13.18)
RST: PLWD_MCU_IO (B2.1 B2.3 C1.1 U1.25), PLWD_LTE_modem (Q4.1 U12.44), PLWD_LTE_SIM (U16.7)
RTSS: PLWD_MCU_IO (U1.47), PLWD_LTE_modem (U13.16)
RXDS: PLWD_MCU_IO (U1.44), PLWD_LTE_modem (U13.15)
sim_CLK: PLWD_MCU_IO (U1.11), PLWD_LTE_modem (U12.46), PLWD_LTE_SIM (U16.9)
sim_Data: PLWD_MCU_IO (U1.10), PLWD_LTE_modem (U12.45), PLWD_LTE_SIM (U16.4)
sim_GND: PLWD_LTE_modem (U12.47), PLWD_LTE_SIM (C54.1 C55.1 CN4.C5 U18.1)
STAS: PLWD_MCU_IO (U1.15), PLWD_LTE_modem (U13.14)
SYS_RESETn: PLWD_MCU_IO (U1.100), PLWD_GNSS_1 (U8.4)
SYS_WAKEUP: PLWD_MCU_IO (U1.41), PLWD_GNSS_1 (U9.4)
TX: PLWD_MCU_IO (U1.37), PLWD_GNSS_1 (U6.4)
TXDS: PLWD_MCU_IO (U1.45), PLWD_LTE_modem (U13.12)
Vant: PLWD_GNSS_RF (R11.2 R13.2), PLWD_GNSS_1 (U11.15)
VCC_RF: PLWD_GNSS_RF (7 pins), PLWD_GNSS_1 (U11.14)